# Altium schematic sheet BLOCK3.SchDoc
size A3; SheetNumber: 3; SheetTotal: 12
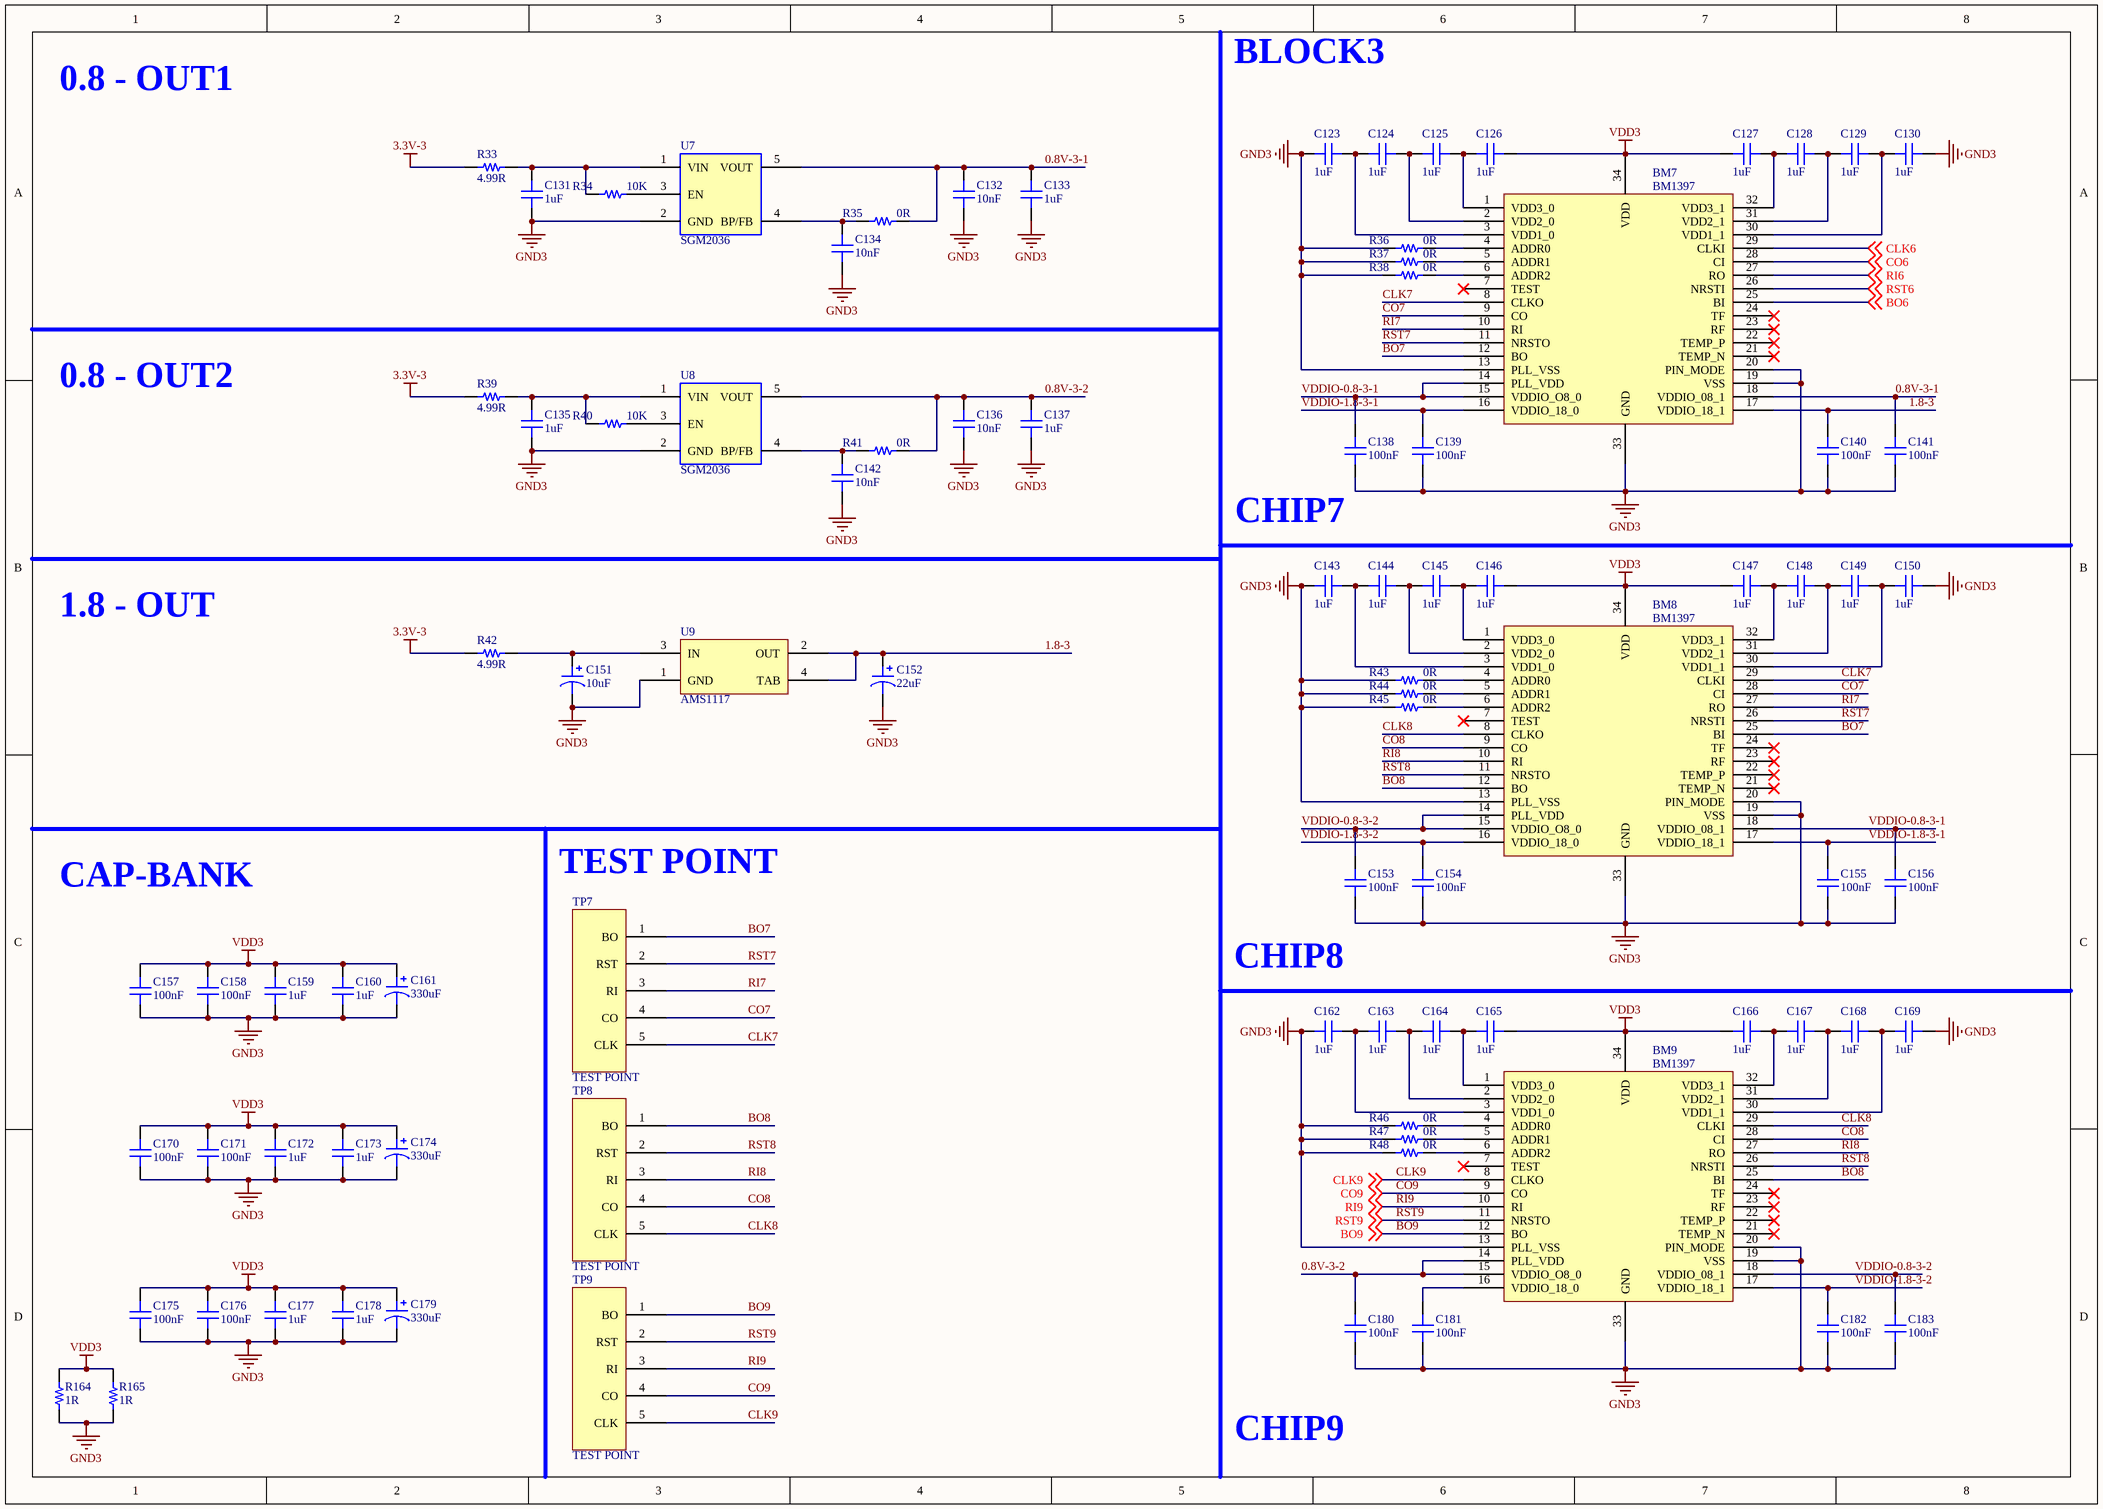
[diagram p0: BLOCK3.SchDoc]

## Parts
BM7  BM1397  [BM1387]
BM8  BM1397  [BM1387]
BM9  BM1397  [BM1387]
C123  1uF  [CAP-SMD-0603]
C124  1uF  [CAP-SMD-0603]
C125  1uF  [CAP-SMD-0603]
C126  1uF  [CAP-SMD-0603]
C127  1uF  [CAP-SMD-0603]
C128  1uF  [CAP-SMD-0603]
C129  1uF  [CAP-SMD-0603]
C130  1uF  [CAP-SMD-0603]
C131  1uF  [CAP_SMD_0805]
C132  10nF  [CAP_SMD_0805]
C133  1uF  [CAP_SMD_0805]
C134  10nF  [CAP_SMD_0805]
C135  1uF  [CAP_SMD_0805]
C136  10nF  [CAP_SMD_0805]
C137  1uF  [CAP_SMD_0805]
C138  100nF  [CAP_SMD_0805]
C139  100nF  [CAP_SMD_0805]
C140  100nF  [CAP_SMD_0805]
C141  100nF  [CAP_SMD_0805]
C142  10nF  [CAP_SMD_0805]
C143  1uF  [CAP-SMD-0603]
C144  1uF  [CAP-SMD-0603]
C145  1uF  [CAP-SMD-0603]
C146  1uF  [CAP-SMD-0603]
C147  1uF  [CAP-SMD-0603]
C148  1uF  [CAP-SMD-0603]
C149  1uF  [CAP-SMD-0603]
C150  1uF  [CAP-SMD-0603]
C151  10uF  [CAP-TAN-CASE-A]
C152  22uF  [CAP-TAN-CASE-A]
C153  100nF  [CAP_SMD_0805]
C154  100nF  [CAP_SMD_0805]
C155  100nF  [CAP_SMD_0805]
C156  100nF  [CAP_SMD_0805]
C157  100nF  [CAP_SMD_0805]
C158  100nF  [CAP_SMD_0805]
C159  1uF  [CAP_SMD_0805]
C160  1uF  [CAP_SMD_0805]
C161  330uF  [CAP-TAN-CASE-E]
C162  1uF  [CAP-SMD-0603]
C163  1uF  [CAP-SMD-0603]
C164  1uF  [CAP-SMD-0603]
C165  1uF  [CAP-SMD-0603]
C166  1uF  [CAP-SMD-0603]
C167  1uF  [CAP-SMD-0603]
C168  1uF  [CAP-SMD-0603]
C169  1uF  [CAP-SMD-0603]
C170  100nF  [CAP_SMD_0805]
C171  100nF  [CAP_SMD_0805]
C172  1uF  [CAP_SMD_0805]
C173  1uF  [CAP_SMD_0805]
C174  330uF  [CAP-TAN-CASE-E]
C175  100nF  [CAP_SMD_0805]
C176  100nF  [CAP_SMD_0805]
C177  1uF  [CAP_SMD_0805]
C178  1uF  [CAP_SMD_0805]
C179  330uF  [CAP-TAN-CASE-E]
C180  100nF  [CAP_SMD_0805]
C181  100nF  [CAP_SMD_0805]
C182  100nF  [CAP_SMD_0805]
C183  100nF  [CAP_SMD_0805]
R33  4.99R  [RES-SMD-1206]
R34  10K  [RES-SMD-0402]
R35  0R  [RES-SMD-0402]
R36  0R  [RES-SMD-0402]
R37  0R  [RES-SMD-0402]
R38  0R  [RES-SMD-0402]
R39  4.99R  [RES-SMD-1206]
R40  10K  [RES-SMD-0402]
R41  0R  [RES-SMD-0402]
R42  4.99R  [RES-SMD-1206]
R43  0R  [RES-SMD-0402]
R44  0R  [RES-SMD-0402]
R45  0R  [RES-SMD-0402]
R46  0R  [RES-SMD-0402]
R47  0R  [RES-SMD-0402]
R48  0R  [RES-SMD-0402]
R164  1R  [RES-SMD-1210]
R165  1R  [RES-SMD-1210]
TP7  TEST POINT  [TEST_POINT]
TP8  TEST POINT  [TEST_POINT]
TP9  TEST POINT  [TEST_POINT]
U7  SGM2036  [SOT23-5PIN]
U8  SGM2036  [SOT23-5PIN]
U9  AMS1117  [AMS1117]

## Nets
3.3V-3: R33.1 R39.1 R42.1
GND3: BM7.13(PLL_VSS) BM7.19(VSS) BM7.20(PIN_MODE) BM7.33(GND) BM8.13(PLL_VSS) BM8.19(VSS) BM8.20(PIN_MODE) BM8.33(GND) BM9.13(PLL_VSS) BM9.19(VSS) BM9.20(PIN_MODE) BM9.33(GND) C123.1 C130.2 C131.1 C132.1 C133.1 C134.1 C135.1 C136.1 C137.1 C138.1 C139.1 C140.1 C141.1 C142.1 C143.1 C150.2 C151.2 C152.2 C153.1 C154.1 C155.1 C156.1 C157.1 C158.1 C159.1 C160.1 C161.2 C162.1 C169.2 C170.1 C171.1 C172.1 C173.1 C174.2 C175.1 C176.1 C177.1 C178.1 C179.2 C180.1 C181.1 C182.1 C183.1 R36.1 R37.1 R38.1 R43.1 R44.1 R45.1 R46.1 R47.1 R48.1 R164.1 R165.1 U7.2(GND) U8.2(GND) U9.1(GND)
VDD3: BM7.34(VDD) BM8.34(VDD) BM9.34(VDD) C126.2 C127.1 C146.2 C147.1 C157.2 C158.2 C159.2 C160.2 C161.1 C165.2 C166.1 C170.2 C171.2 C172.2 C173.2 C174.1 C175.2 C176.2 C177.2 C178.2 C179.1 R164.2 R165.2
0.8V-3-1: BM7.18(VDDIO_08_1) C132.2 C133.2 C141.2 R35.2 U7.5(VOUT)
0.8V-3-2: BM9.14(PLL_VDD) BM9.15(VDDIO_O8_0) C136.2 C137.2 C180.2 R41.2 U8.5(VOUT)
1.8-3: BM7.17(VDDIO_18_1) C140.2 C152.1 U9.2(OUT) U9.4(TAB)
BO6: BM7.25(BI) ; off-sheet BO6
BO7: BM7.12(BO) BM8.25(BI) TP7.1(BO)
BO8: BM8.12(BO) BM9.25(BI) TP8.1(BO)
BO9: BM9.12(BO) TP9.1(BO) ; off-sheet BO9
CLK6: BM7.29(CLKI) ; off-sheet CLK6
CLK7: BM7.8(CLKO) BM8.29(CLKI) TP7.5(CLK)
CLK8: BM8.8(CLKO) BM9.29(CLKI) TP8.5(CLK)
CLK9: BM9.8(CLKO) TP9.5(CLK) ; off-sheet CLK9
CO6: BM7.28(CI) ; off-sheet CO6
CO7: BM7.9(CO) BM8.28(CI) TP7.4(CO)
CO8: BM8.9(CO) BM9.28(CI) TP8.4(CO)
CO9: BM9.9(CO) TP9.4(CO) ; off-sheet CO9
RI6: BM7.27(RO) ; off-sheet RI6
RI7: BM7.10(RI) BM8.27(RO) TP7.3(RI)
RI8: BM8.10(RI) BM9.27(RO) TP8.3(RI)
RI9: BM9.10(RI) TP9.3(RI) ; off-sheet RI9
RST6: BM7.26(NRSTI) ; off-sheet RST6
RST7: BM7.11(NRSTO) BM8.26(NRSTI) TP7.2(RST)
RST8: BM8.11(NRSTO) BM9.26(NRSTI) TP8.2(RST)
RST9: BM9.11(NRSTO) TP9.2(RST) ; off-sheet RST9
VDDIO-0.8-3-1: BM7.14(PLL_VDD) BM7.15(VDDIO_O8_0) BM8.18(VDDIO_08_1) C138.2 C156.2
VDDIO-0.8-3-2: BM8.14(PLL_VDD) BM8.15(VDDIO_O8_0) BM9.18(VDDIO_08_1) C153.2 C183.2
VDDIO-1.8-3-1: BM7.16(VDDIO_18_0) BM8.17(VDDIO_18_1) C139.2 C155.2
VDDIO-1.8-3-2: BM8.16(VDDIO_18_0) BM9.17(VDDIO_18_1) C154.2 C182.2
NetBM7_1: BM7.1(VDD3_0) C125.2 C126.1
NetBM7_2: BM7.2(VDD2_0) C124.2 C125.1
NetBM7_3: BM7.3(VDD1_0) C123.2 C124.1
NetBM7_4: BM7.4(ADDR0) R36.2
NetBM7_5: BM7.5(ADDR1) R37.2
NetBM7_6: BM7.6(ADDR2) R38.2
NetBM7_30: BM7.30(VDD1_1) C129.2 C130.1
NetBM7_31: BM7.31(VDD2_1) C128.2 C129.1
NetBM7_32: BM7.32(VDD3_1) C127.2 C128.1
NetBM8_1: BM8.1(VDD3_0) C145.2 C146.1
NetBM8_2: BM8.2(VDD2_0) C144.2 C145.1
NetBM8_3: BM8.3(VDD1_0) C143.2 C144.1
NetBM8_4: BM8.4(ADDR0) R43.2
NetBM8_5: BM8.5(ADDR1) R44.2
NetBM8_6: BM8.6(ADDR2) R45.2
NetBM8_30: BM8.30(VDD1_1) C149.2 C150.1
NetBM8_31: BM8.31(VDD2_1) C148.2 C149.1
NetBM8_32: BM8.32(VDD3_1) C147.2 C148.1
NetBM9_1: BM9.1(VDD3_0) C164.2 C165.1
NetBM9_2: BM9.2(VDD2_0) C163.2 C164.1
NetBM9_3: BM9.3(VDD1_0) C162.2 C163.1
NetBM9_4: BM9.4(ADDR0) R46.2
NetBM9_5: BM9.5(ADDR1) R47.2
NetBM9_6: BM9.6(ADDR2) R48.2
NetBM9_16: BM9.16(VDDIO_18_0) C181.2
NetBM9_30: BM9.30(VDD1_1) C168.2 C169.1
NetBM9_31: BM9.31(VDD2_1) C167.2 C168.1
NetBM9_32: BM9.32(VDD3_1) C166.2 C167.1
NetC131_2: C131.2 R33.2 R34.1 U7.1(VIN)
NetC134_2: C134.2 R35.1 U7.4(BP/FB)
NetC135_2: C135.2 R39.2 R40.1 U8.1(VIN)
NetC142_2: C142.2 R41.1 U8.4(BP/FB)
NetC151_1: C151.1 R42.2 U9.3(IN)
NetR34_2: R34.2 U7.3(EN)
NetR40_2: R40.2 U8.3(EN)

Not connected (* = marked no-connect by the designer): BM7 7(TEST)* 21(TEMP_N)* 22(TEMP_P)* 23(RF)* 24(TF)*; BM8 7(TEST)* 21(TEMP_N)* 22(TEMP_P)* 23(RF)* 24(TF)*; BM9 7(TEST)* 21(TEMP_N)* 22(TEMP_P)* 23(RF)* 24(TF)*

## Notes on the sheet
- 0.8 - OUT1
- BLOCK3
- 0.8 - OUT2
- CHIP7
- 1.8 - OUT
- CAP-BANK
- TEST POINT
- CHIP8
- CHIP9

## Library data of the parts
BM7-BM9 = BM1397_0
C123-C150 C153-C160 C162-C173 C175-C178 C180-C183 = CAP
C151 C152 C161 C174 C179 = POLARIZED CAP
R33-R48 R164 R165 = RES